# EAGLE design atmega128ictop (EAGLE 7.5.0)
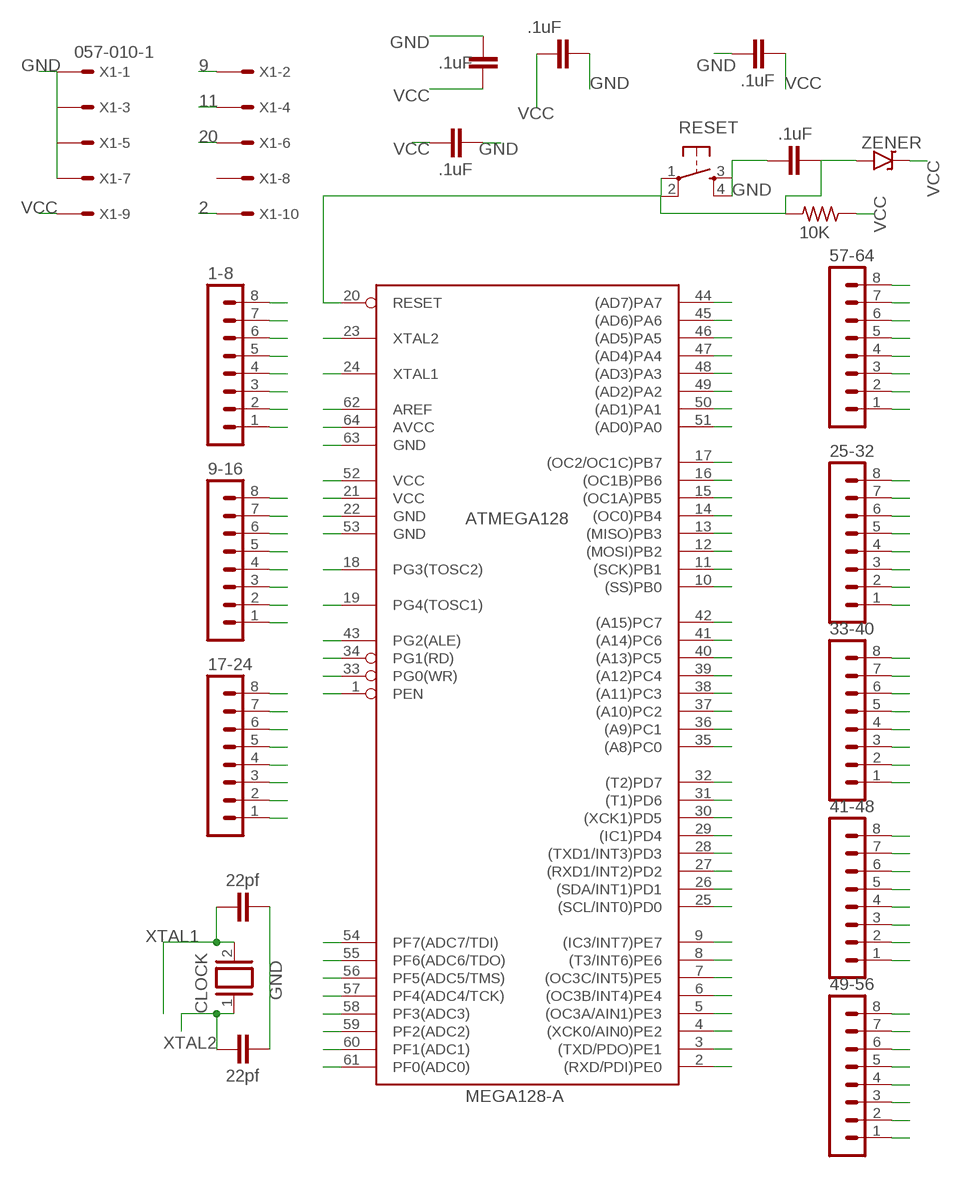
[diagram p0: schematic, sheet 1]

## Parts
1-8  MA08-1  [MA08-1]
9-16  MA08-1  [MA08-1]
17-24  MA08-1  [MA08-1]
25-32  MA08-1  [MA08-1]
33-40  MA08-1  [MA08-1]
41-48  MA08-1  [MA08-1]
49-56  MA08-1  [MA08-1]
57-64  MA08-1  [MA08-1]
ATMEGA128  MEGA128-A  [TQFP64]
C1  .1uF  C5/2.5  [C5B2.5]
C2  .1uF  C5/2.5  [C5B2.5]
C3  22pf  C5/2.5  [C5B2.5]
C4  22pf  C5/2.5  [C5B2.5]
C5  .1uF  C5/2.5  [C5B2.5]
C6  .1uF  C5/2.5  [C5B2.5]
C7  .1uF  C5/2.5  [C5B2.5]
CLOCK  XTAL/S  [QS]
D1  ZENER  1N9ZENER2  [DO35-2]
R1  10K  R-US_0204/5  [0204/5]
RESET  DTS-6  [DTS-6]
X1  057-010-1  [057-010-1]

## Nets
1: 1-8.1 ATMEGA128.1(PEN)
2: 1-8.2 ATMEGA128.2((RXD/PDI)PE0) X1.10
3: 1-8.3 ATMEGA128.3((TXD/PDO)PE1)
4: 1-8.4 ATMEGA128.4((XCK0/AIN0)PE2)
5: 1-8.5 ATMEGA128.5((OC3A/AIN1)PE3)
6: 1-8.6 ATMEGA128.6((OC3B/INT4)PE4)
7: 1-8.7 ATMEGA128.7((OC3C/INT5)PE5)
8: 1-8.8 ATMEGA128.8((T3/INT6)PE6)
9: 9-16.1 ATMEGA128.9((IC3/INT7)PE7) X1.2
10: 9-16.2 ATMEGA128.10((SS)PB0)
11: 9-16.3 ATMEGA128.11((SCK)PB1) X1.4
12: 9-16.4 ATMEGA128.12((MOSI)PB2)
13: 9-16.5 ATMEGA128.13((MISO)PB3)
14: 9-16.6 ATMEGA128.14((OC0)PB4)
15: 9-16.7 ATMEGA128.15((OC1A)PB5)
16: 9-16.8 ATMEGA128.16((OC1B)PB6)
17: 17-24.1 ATMEGA128.17((OC2/OC1C)PB7)
18: 17-24.2 ATMEGA128.18(PG3(TOSC2))
19: 17-24.3 ATMEGA128.19(PG4(TOSC1))
20: 17-24.4 ATMEGA128.20(RESET) C5.1 D1.A R1.2 RESET.1 RESET.2 X1.6
25: 25-32.1 ATMEGA128.25((SCL/INT0)PD0)
26: 25-32.2 ATMEGA128.26((SDA/INT1)PD1)
27: 25-32.3 ATMEGA128.27((RXD1/INT2)PD2)
28: 25-32.4 ATMEGA128.28((TXD1/INT3)PD3)
29: 25-32.5 ATMEGA128.29((IC1)PD4)
30: 25-32.6 ATMEGA128.30((XCK1)PD5)
31: 25-32.7 ATMEGA128.31((T1)PD6)
32: 25-32.8 ATMEGA128.32((T2)PD7)
33: 33-40.1 ATMEGA128.33(PG0(WR))
34: 33-40.2 ATMEGA128.34(PG1(RD))
35: 33-40.3 ATMEGA128.35((A8)PC0)
36: 33-40.4 ATMEGA128.36((A9)PC1)
37: 33-40.5 ATMEGA128.37((A10)PC2)
38: 33-40.6 ATMEGA128.38((A11)PC3)
39: 33-40.7 ATMEGA128.39((A12)PC4)
40: 33-40.8 ATMEGA128.40((A13)PC5)
41: 41-48.1 ATMEGA128.41((A14)PC6)
42: 41-48.2 ATMEGA128.42((A15)PC7)
43: 41-48.3 ATMEGA128.43(PG2(ALE))
44: 41-48.4 ATMEGA128.44((AD7)PA7)
45: 41-48.5 ATMEGA128.45((AD6)PA6)
46: 41-48.6 ATMEGA128.46((AD5)PA5)
47: 41-48.7 ATMEGA128.47((AD4)PA4)
48: 41-48.8 ATMEGA128.48((AD3)PA3)
49: 49-56.1 ATMEGA128.49((AD2)PA2)
50: 49-56.2 ATMEGA128.50((AD1)PA1)
51: 49-56.3 ATMEGA128.51((AD0)PA0)
54: 49-56.6 ATMEGA128.54(PF7(ADC7/TDI))
55: 49-56.7 ATMEGA128.55(PF6(ADC6/TDO))
56: 49-56.8 ATMEGA128.56(PF5(ADC5/TMS))
57: 57-64.1 ATMEGA128.57(PF4(ADC4/TCK))
58: 57-64.2 ATMEGA128.58(PF3(ADC3))
59: 57-64.3 ATMEGA128.59(PF2(ADC2))
60: 57-64.4 ATMEGA128.60(PF1(ADC1))
61: 57-64.5 ATMEGA128.61(PF0(ADC0))
62: 57-64.6
GND: 17-24.6 49-56.5 57-64.7 ATMEGA128.22(GND) ATMEGA128.53(GND) ATMEGA128.63(GND) C1.1 C2.2 C3.2 C4.2 C5.2 C6.2 C7.2 RESET.3 RESET.4 X1.1 X1.3 X1.5 X1.7
VCC: 17-24.5 49-56.4 57-64.8 ATMEGA128.21(VCC) ATMEGA128.52(VCC) ATMEGA128.62(AREF) ATMEGA128.64(AVCC) C1.2 C2.1 C6.1 C7.1 D1.C R1.1 X1.9
XTAL1: 17-24.8 ATMEGA128.24(XTAL1) C3.1 CLOCK.2
XTAL2: 17-24.7 ATMEGA128.23(XTAL2) C4.1 CLOCK.1
Unconnected: X1.8

## Library data of the parts
1-8 9-16 17-24 25-32 33-40 41-48 49-56 57-64 = con-lstb:MA08-1: PIN HEADER; OC_FARNELL: unknown; OC_NEWARK: unknown
ATMEGA128 = atmel:MEGA128: MICROCONTROLLER 128 Kbytes FLASH 4 Kbytes SRAM 4 Kbytes EEPROM DUAL USART 8-channel 10 bit ADC Source: avr.lbr; MPN: ATMEGA128-16AU; OC_FARNELL: 9171118; OC_NEWARK: 95K7364
C1-C7 = capacitor-wima:C: CAPACITOR naming: grid - package width
CLOCK = special:XTAL/S: CRYSTAL
D1 = gm-diodes:1N9*ZENER: 1N9???B Zener Diode DO-35 case 1N957B - 1N992B (6.8V to 200V)
R1 = resistor:R-US_: RESISTOR, American symbol
RESET = switch-tact:DTS-6
X1 = con-panduit:057-010-: CONNECTOR 10-pin series 057 contact pc board low profile headers; OC_FARNELL: unknown; OC_NEWARK: unknown

## Net classes
0 default: clearance 0.205 mm

## Board
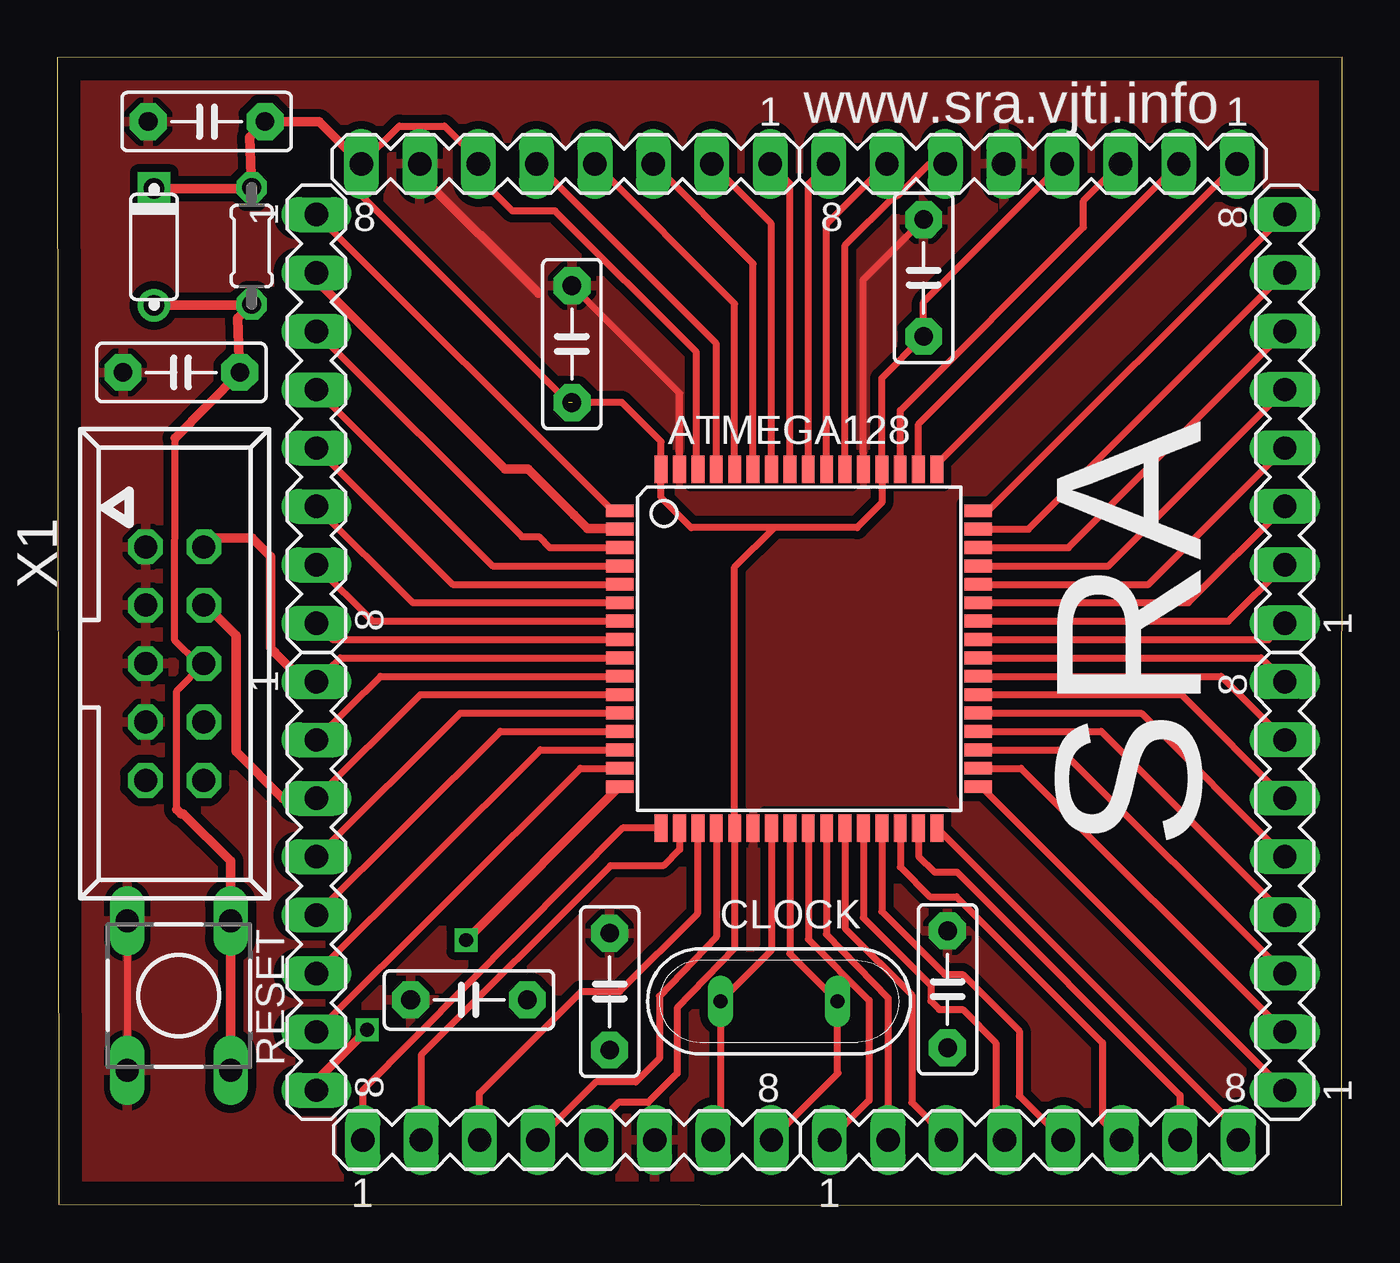
[diagram p1: board, top side]
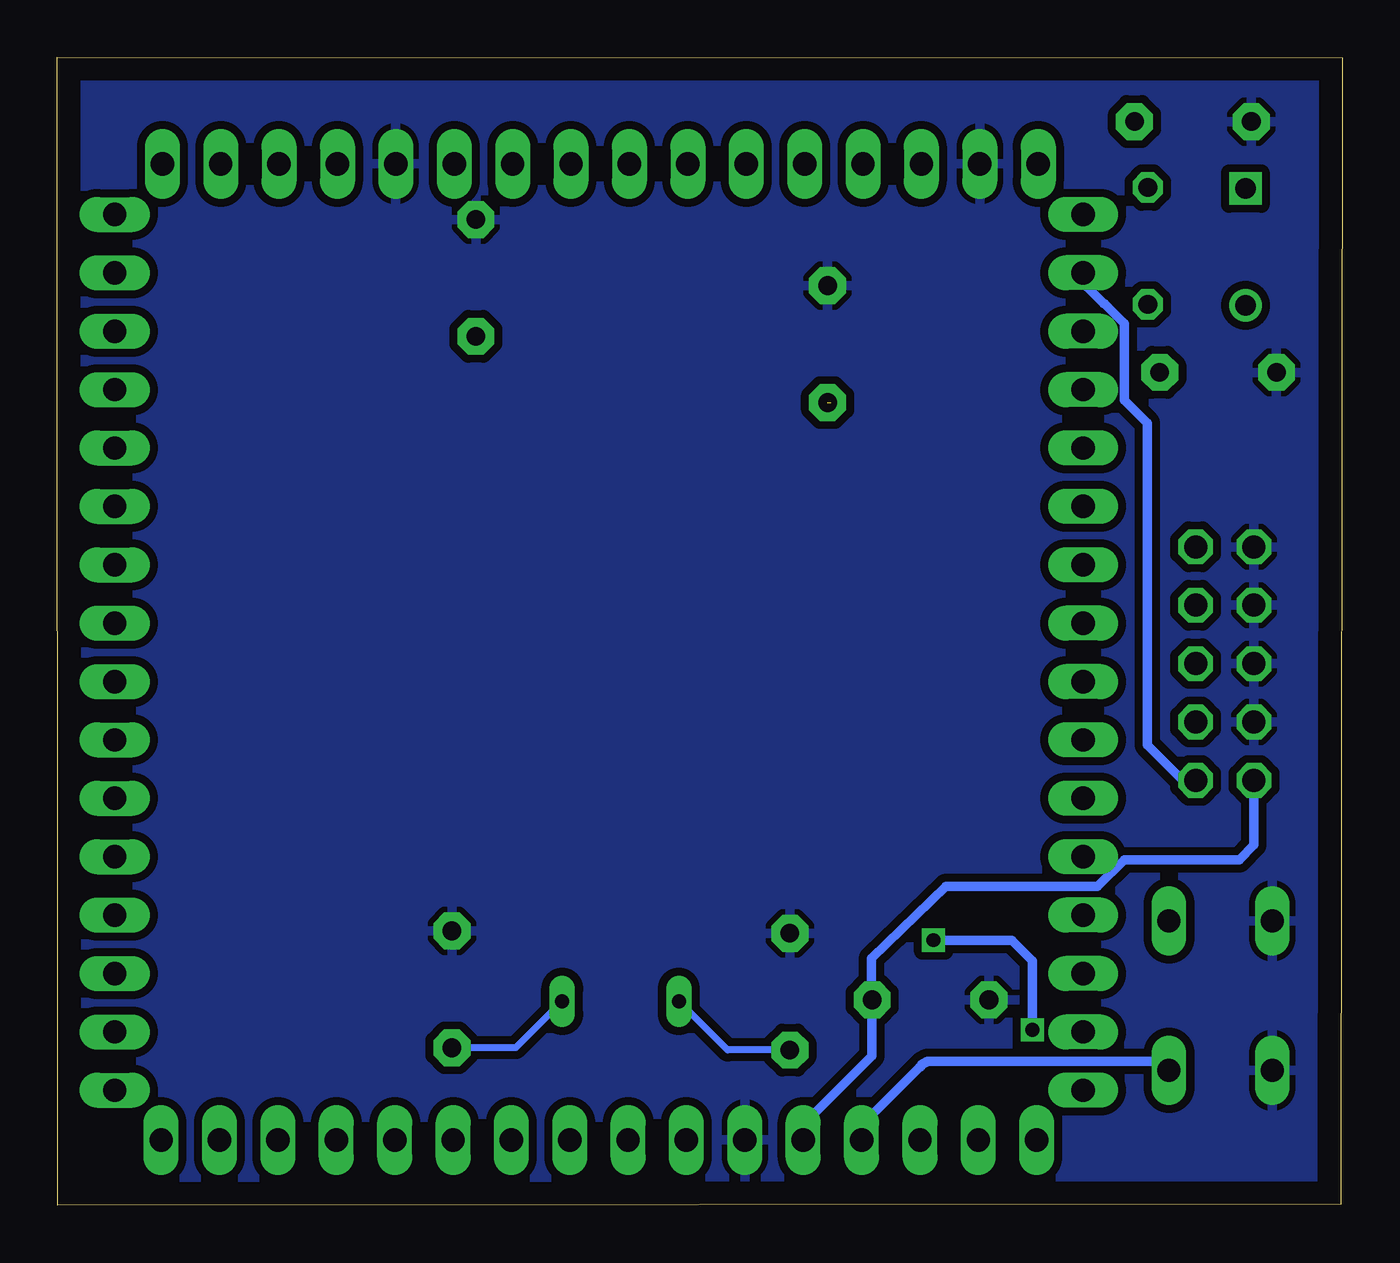
[diagram p2: board, bottom side, seen from below]

Size 55.88 x 49.93 mm. Coordinates in mm from the lower left corner, seen from the top.
Outline: 0.05,0.03 55.87,0 55.88,49.93 0,49.92 0.05,0.03
Copper layers (1*16): Top 0.035mm / dielectric 1.5mm / Bottom 0.035mm
Design rules "default *": minimum track width 10mil, minimum drill 10mil, track to track 0.35mm, track to pad 0.25mm, pad to pad 8mil, via to via 8mil, smd to smd 8mil, copper to edge 40mil, drill to drill 8mil, minimum pad ring 10mil, minimum via ring 8mil, stop-mask expansion 4mil, vias tented up to drill 0mil, thermal gap 10mil

### Footprints (pad centres in the part's own frame; a part is rotated, then mirrored left to right if it is on the bottom)
MA08-1 = drill 1.016 long: 1 -8.89,0; 2 -6.35,0; 3 -3.81,0; 4 -1.27,0; 5 1.27,0; 6 3.81,0; 7 6.35,0; 8 8.89,0
TQFP64 = smd 1.194 x 0.559: 1 -7.8,6; 2 -7.8,5.2; 3 -7.8,4.4; 4 -7.8,3.6; 5 -7.8,2.8; 6 -7.8,2; 7 -7.8,1.2; 8 -7.8,0.4; 9 -7.8,-0.4; 10 -7.8,-1.2; 11 -7.8,-2; 12 -7.8,-2.8; 13 -7.8,-3.6; 14 -7.8,-4.4; 15 -7.8,-5.2; 16 -7.8,-6; 33 7.8,-6; 34 7.8,-5.2; 35 7.8,-4.4; 36 7.8,-3.6; 37 7.8,-2.8; 38 7.8,-2; 39 7.8,-1.2; 40 7.8,-0.4; 41 7.8,0.4; 42 7.8,1.2; 43 7.8,2; 44 7.8,2.8; 45 7.8,3.6; 46 7.8,4.4; 47 7.8,5.2; 48 7.8,6 | smd 0.559 x 1.194: 17 -6,-7.8; 18 -5.2,-7.8; 19 -4.4,-7.8; 20 -3.6,-7.8; 21 -2.8,-7.8; 22 -2,-7.8; 23 -1.2,-7.8; 24 -0.4,-7.8; 25 0.4,-7.8; 26 1.2,-7.8; 27 2,-7.8; 28 2.8,-7.8; 29 3.6,-7.8; 30 4.4,-7.8; 31 5.2,-7.8; 32 6,-7.8; 49 6,7.8; 50 5.2,7.8; 51 4.4,7.8; 52 3.6,7.8; 53 2.8,7.8; 54 2,7.8; 55 1.2,7.8; 56 0.4,7.8; 57 -0.4,7.8; 58 -1.2,7.8; 59 -2,7.8; 60 -2.8,7.8; 61 -3.6,7.8; 62 -4.4,7.8; 63 -5.2,7.8; 64 -6,7.8
C5B2.5 = drill 0.813 pad 1.6 octagon: 1 -2.54,0; 2 2.54,0
QS = drill 0.61 long: 1 -2.54,0; 2 2.54,0
DO35-2 = drill 0.9: A 2.54,0 | drill 0.9 square: C -2.54,0
0204/5 = drill 0.813 octagon: 1 -2.54,0; 2 2.54,0
DTS-6 = drill 1 long: 1 -3.25,2.25; 2 3.25,2.25; 3 -3.25,-2.25; 4 3.25,-2.25
057-010-1 = drill 1 octagon: 1 -5.08,-1.27; 2 -5.08,1.27; 3 -2.54,-1.27; 4 -2.54,1.27; 5 0,-1.27; 6 0,1.27; 7 2.54,-1.27; 8 2.54,1.27; 9 5.08,-1.27; 10 5.08,1.27

### Placement (x,y rotation side)
1-8  11.26,34.21 270 top
9-16  11.26,13.89 270 top
17-24  22.17,2.84 0 top
25-32  42.48,2.84 0 top
33-40  53.39,13.89 90 top
41-48  53.39,34.21 90 top
49-56  42.43,45.3 180 top
57-64  22.11,45.3 180 top
ATMEGA128  32.26,24.21 0 top
C1  6.49,47.14 0 top
C2  17.9,8.93 180 top
C3  38.72,9.39 90 top
C4  24.02,9.29 90 top
C5  5.39,36.23 180 top
C6  22.38,37.46 90 top
C7  37.68,40.34 90 top
CLOCK  31.39,8.87 0 top
D1  4.2,41.69 270 top
R1  8.45,41.73 270 top
RESET  5.28,9.12 270 top
X1  5.1,23.56 270 top

### Tracks (layer width: path | path; a pad name or v marks a point on that pad's centre or on a via)
1
  Top 0.305: 1-8.1 24.15,30.21 ATMEGA128.1
2
  Top 0.406: 1-8.2 11.26,40.24 19.47,32.03 20.47,32.03 22.47,30.03 22.47,30.02 23.05,29.44 24.43,29.44 ATMEGA128.2
  Bottom 0.406: X1.10 6.92,18.48 8.47,20.03 8.47,34.03 9.47,35.03 9.47,38.35 10.35,39.23 10.37,39.23 11.07,39.93 11.07,40.37 1-8.2
3
  Top 0.305: ATMEGA128.3 21.41,28.61 20.94,29.08 20.2,29.08 1-8.3
4
  Top 0.305: 1-8.4 18.93,27.81 ATMEGA128.4
5
  Top 0.305: 1-8.5 17.19,27.01 ATMEGA128.5
6
  Top 0.305: 1-8.6 15.45,26.21 ATMEGA128.6
7
  Top 0.305: 1-8.7 13.71,25.41 ATMEGA128.7
8
  Top 0.305: 1-8.8 11.97,24.61 ATMEGA128.8
9
  Top 0.305: 9-16.1 12.31,23.81 ATMEGA128.9
  Top 0.406: 9-16.1 10.72,22.78 9.47,24.03 9.47,24.05 9.27,24.25 9.27,28.23 8.47,29.03 6.76,29.03 X1.2
10
  Top 0.305: 9-16.2 14.05,23.01 ATMEGA128.10
11
  Top 0.305: 9-16.3 15.79,22.21 ATMEGA128.11
  Top 0.406: 9-16.3 9.8,17.7 7.77,19.73 7.77,24.78 6.45,26.1 X1.4
12
  Top 0.305: 9-16.4 17.53,21.41 ATMEGA128.12
13
  Top 0.305: 9-16.5 19.27,20.61 ATMEGA128.13
14
  Top 0.305: 9-16.6 21.01,19.81 ATMEGA128.14
15
  Top 0.305: 9-16.7 22.75,19.01 ATMEGA128.15
16  (via drill 0.6)
  Top 0.305: 24.46,18.18 ATMEGA128.16
  Top 0.406: 9-16.8 11.26,5.42 v13.47,7.63 | v17.77,11.53 v17.78,11.53 ATMEGA128.16
  Bottom 0.406: v13.47,7.63 13.47,10.63 14.37,11.53 v17.77,11.53
17
  Top 0.305: ATMEGA128.17 24.59,16.41 13.28,5 17-24.1
18
  Top 0.305: ATMEGA128.18 27.06,15.47 26.36,14.77 24.05,14.77 15.82,6.54 17-24.2
19
  Top 0.305: 17-24.3 18.36,4.87 22.79,9.3 24.46,9.3 27.86,12.7 ATMEGA128.19
20
  Top 0.305: ATMEGA128.20 28.66,11.67 26.18,9.09 26.18,6.38 25.16,5.36 23.42,5.36 17-24.4 | 5.19,17.22 5.19,22.38 X1.6 | 6.13,23.56 5.1,24.56 5.13,33.38
  Top 0.406: D1.A 8.41,39.15 R1.2 7.84,38.58 C5.1 5.13,33.38 | RESET.2 RESET.1 7.53,14.97 5.47,17.03 5.38,17.03 5.19,17.22 | X1.6 6.13,23.56
  Bottom 0.406: 17-24.4 20.9,3.48 18.38,6 18.36,6 18.3,6.06 18.3,6.1 18.04,6.25 7.88,6.25 RESET.2
25
  Top 0.305: ATMEGA128.25 32.66,11.57 35.31,8.92 35.31,4.56 25-32.1
26
  Top 0.305: ATMEGA128.26 33.45,11.79 36.13,9.02 25-32.2
27
  Top 0.305: ATMEGA128.27 34.26,12.05 37.16,9.15 37.16,4.47 38.67,2.96 25-32.3
28
  Top 0.305: ATMEGA128.28 35.06,12.5 37.99,9.57 37.99,8.88 38.36,8.51 39.38,8.51 40.82,7.07 40.82,3.23 25-32.4
29
  Top 0.305: ATMEGA128.29 35.86,12.78 38.6,10.04 39.38,10.04 41.84,7.58 41.84,4.75 25-32.5
30
  Top 0.305: ATMEGA128.30 36.66,14.71 37.95,13.42 39.11,13.42 45.46,7.07 45.46,3.67 25-32.6
31
  Top 0.305: ATMEGA128.31 37.46,15.18 38.15,14.49 39.13,14.49 48.83,4.79 25-32.7
32
  Top 0.305: ATMEGA128.32 51.37,3.3 25-32.8
33
  Top 0.305: ATMEGA128.33 40.18,18.21 33-40.1
34
  Top 0.305: ATMEGA128.34 41.92,19.01 33-40.2
35
  Top 0.305: ATMEGA128.35 43.66,19.81 33-40.3
36
  Top 0.305: ATMEGA128.36 45.4,20.61 33-40.4
37
  Top 0.305: ATMEGA128.37 47.14,21.41 33-40.5
38
  Top 0.305: ATMEGA128.38 48.88,22.21 33-40.6
39
  Top 0.305: ATMEGA128.39 50.62,23.01 33-40.7
40
  Top 0.305: ATMEGA128.40 52.36,23.81 33-40.8
41
  Top 0.305: ATMEGA128.41 52.68,24.61 41-48.1
42
  Top 0.305: ATMEGA128.42 50.94,25.41 41-48.2
43
  Top 0.305: ATMEGA128.43 49.2,26.21 41-48.3
44
  Top 0.305: ATMEGA128.44 47.46,27.01 41-48.4
45
  Top 0.305: ATMEGA128.45 45.72,27.81 41-48.5
46
  Top 0.305: ATMEGA128.46 43.98,28.61 41-48.6
47
  Top 0.305: ATMEGA128.47 42.24,29.41 41-48.7
48
  Top 0.305: ATMEGA128.48 40.5,30.21 41-48.8
49
  Top 0.305: ATMEGA128.49 38.26,32.24 49-56.1
50
  Top 0.305: ATMEGA128.50 37.46,33.98 49-56.2
51
  Top 0.305: ATMEGA128.51 36.66,34.57 44.63,42.54 44.63,43.69 49-56.3
54
  Top 0.305: ATMEGA128.54 34.26,41.76 36.42,43.92 36.56,43.92 37.94,45.3 49-56.6
55
  Top 0.305: ATMEGA128.55 33.46,42.68 49-56.7
56
  Top 0.305: ATMEGA128.56 32.66,44.42 49-56.8
57
  Top 0.305: ATMEGA128.57 31.86,44.44 57-64.1
58
  Top 0.305: ATMEGA128.58 31.06,42.7 57-64.2
59
  Top 0.305: ATMEGA128.59 30.26,40.96 57-64.3
60
  Top 0.305: ATMEGA128.60 29.46,39.22 57-64.4
61
  Top 0.305: ATMEGA128.61 28.66,37.48 57-64.5
GND
  Top 0.305: ATMEGA128.53 35.06,40.26 C7.2 | ATMEGA128.63 27.06,35.32 C6.2 | RESET.3 RESET.4
  Top 0.406: 57-64.7 15.76,44.84 20.93,39.67
  pour Bottom: 0.19,49.78 55.68,49.7 55.66,0.22 0.25,0.22
  pour Top: 0.16,49.71 55.71,49.72 55.64,0.21 0.27,0.23
VCC  (1 unrouted)
  Top 0.305: 49-56.4 37.68,39.28 C7.1 35.86,35.98 ATMEGA128.52 35.86,30.56 34.78,29.48 31.18,29.48 | 31.18,29.48 27.57,29.48 26.26,30.79 ATMEGA128.64 26.26,33.21 24.55,34.92 C6.1 | ATMEGA128.62 27.79,32.08 27.79,37.11 21.65,43.25 19.79,43.25 18.27,44.77 18.33,44.83 18.33,45.46 16.84,46.95 14.87,46.95 57-64.8 | 17-24.5 23.44,3.5 24.41,4.47 25.7,4.47 26.96,5.73 26.96,8.58 29.46,11.18 ATMEGA128.21 29.46,27.76 31.18,29.48 | 13.12,45.4 57-64.8 | 22.23,34.92 13.22,43.93 57-64.8
  Top 0.406: 57-64.8 11.38,47.14 C1.2 8.36,46.47 R1.1 8.41,44.23 D1.C
  Bottom 0.406: 17-24.5 23.44,3.5 20.44,6.5 C2.1 20.47,8.96 20.47,10.73 17.24,13.86 10.64,13.86 9.47,15.03 4.47,15.03 3.83,15.67 X1.9
XTAL1
  Top 0.305: ATMEGA128.24 31.86,10.94 CLOCK.2 33.93,5.77 33.96,5.74 17-24.8
  Bottom 0.305: CLOCK.2 35.95,6.85 C3.1
XTAL2
  Top 0.305: ATMEGA128.23 31.06,11.08 CLOCK.1 28.85,3.17 17-24.7
  Bottom 0.305: C4.1 26.73,6.75 CLOCK.1

### Text on the board
tNames: www.sra.vjti.info | SRA